# EAGLE schematic xbeeBoard (EAGLE 6.5.0)
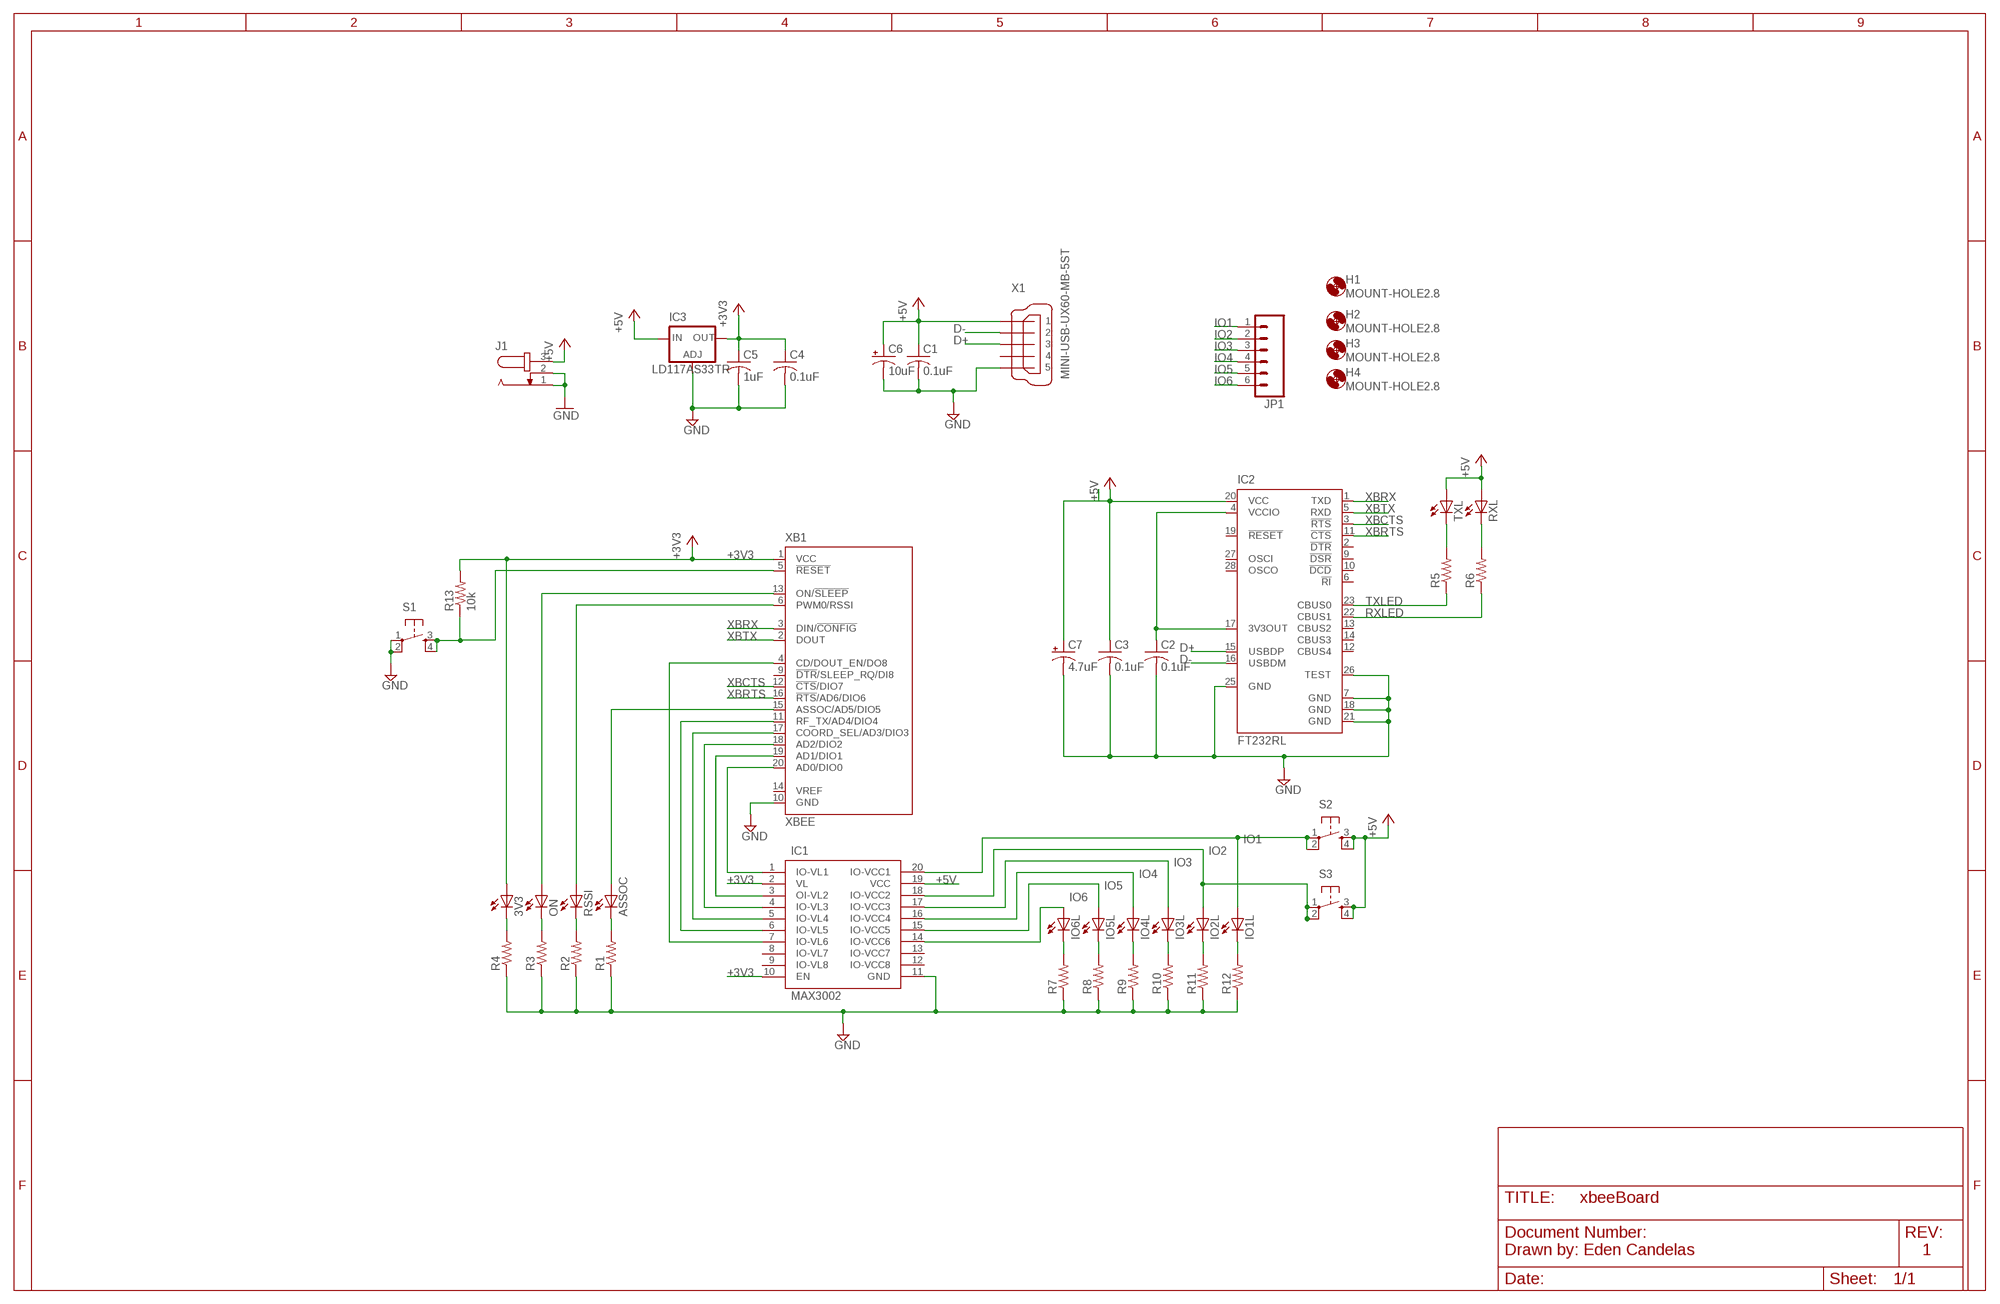
[diagram p0: schematic, sheet 1]

## Parts
3V3  LEDCHIPLED_1206  [CHIPLED_1206]
ASSOC  LEDCHIPLED_1206  [CHIPLED_1206]
C1  0.1uF  C-USC1206K  [C1206K]
C2  0.1uF  C-USC1206K  [C1206K]
C3  0.1uF  C-USC1206K  [C1206K]
C4  0.1uF  C-USC1206K  [C1206K]
C5  1uF  C-USC1206K  [C1206K]
C6  10uF  CAP_POL1206  [EIA3216]
C7  4.7uF  CAP_POL1206  [EIA3216]
H1  MOUNT-HOLE2.8  [2,8]
H2  MOUNT-HOLE2.8  [2,8]
H3  MOUNT-HOLE2.8  [2,8]
H4  MOUNT-HOLE2.8  [2,8]
IC1  MAX3002  [TSSOP-20]
IC2  FT232RL  [SSOP28]
IC3  LD117AS33TR  [SOT223]
IO1L  LEDCHIPLED_1206  [CHIPLED_1206]
IO2L  LEDCHIPLED_1206  [CHIPLED_1206]
IO3L  LEDCHIPLED_1206  [CHIPLED_1206]
IO4L  LEDCHIPLED_1206  [CHIPLED_1206]
IO5L  LEDCHIPLED_1206  [CHIPLED_1206]
IO6L  LEDCHIPLED_1206  [CHIPLED_1206]
J1  JACK-PLUG0  [SPC4077]
JP1  M06LONGPADS  [1X06_LONGPADS]
ON  LEDCHIPLED_1206  [CHIPLED_1206]
R1  R-US_R1206  [R1206]
R2  R-US_R1206  [R1206]
R3  R-US_R1206  [R1206]
R4  R-US_R1206  [R1206]
R5  R-US_R1206  [R1206]
R6  R-US_R1206  [R1206]
R7  R-US_R1206  [R1206]
R8  R-US_R1206  [R1206]
R9  R-US_R1206  [R1206]
R10  R-US_R1206  [R1206]
R11  R-US_R1206  [R1206]
R12  R-US_R1206  [R1206]
R13  10k  R-US_R1206  [R1206]
RSSI  LEDCHIPLED_1206  [CHIPLED_1206]
RXL  LEDCHIPLED_1206  [CHIPLED_1206]
S1  TAC_SWITCHPTH  [TACTILE-PTH]
S2  TAC_SWITCHPTH  [TACTILE-PTH]
S3  TAC_SWITCHPTH  [TACTILE-PTH]
TXL  LEDCHIPLED_1206  [CHIPLED_1206]
X1  MINI-USB-UX60-MB-5ST  [UX60-MB-5ST]
XB1  XBEE  [XBEE]

## Nets
+3V3: 3V3.A C4.1 C5.1 IC1.2(VL) IC1.10(EN) IC3.4(OUT) R13.2 XB1.1(VCC)
+5V: C1.1 C3.1 C6.A(+) C7.A(+) IC1.19(VCC) IC2.20(VCC) IC3.3(IN) J1.3 RXL.A S2.3 S2.4 S3.3 S3.4 TXL.A X1.1
D+: IC2.15(USBDP) X1.3
D-: IC2.16(USBDM) X1.2
GND: C1.2 C2.2 C3.2 C4.2 C5.2 C6.C(-) C7.C(-) IC1.11(GND) IC2.7(GND) IC2.18(GND) IC2.21(GND) IC2.25(GND) IC2.26(TEST) IC3.1(ADJ) J1.1 J1.2 R1.1 R2.1 R3.1 R4.1 R7.1 R8.1 R9.1 R10.1 R11.1 R12.1 S1.1 S1.2 X1.5 XB1.10(GND)
IO1: IC1.20(IO-VCC1) IO1L.A JP1.1 S2.1 S2.2
IO2: IC1.18(IO-VCC2) IO2L.A JP1.2 S3.1 S3.2
IO3: IC1.17(IO-VCC3) IO3L.A JP1.3
IO4: IC1.16(IO-VCC4) IO4L.A JP1.4
IO5: IC1.15(IO-VCC5) IO5L.A JP1.5
IO6: IC1.14(IO-VCC6) IO6L.A JP1.6
N$1: IC1.1(IO-VL1) XB1.20(AD0/DIO0)
N$2: IC1.3(OI-VL2) XB1.19(AD1/DIO1)
N$3: IC1.4(IO-VL3) XB1.18(AD2/DIO2)
N$4: IC1.6(IO-VL5) XB1.11(RF_TX/AD4/DIO4)
N$5: IC1.5(IO-VL4) XB1.17(COORD_SEL/AD3/DIO3)
N$6: ASSOC.A XB1.15(ASSOC/AD5/DIO5)
N$7: RSSI.A XB1.6(PWM0/RSSI)
N$8: ON.A XB1.13(ON/!SLEEP)
N$10: R6.2 RXL.C
N$11: IC1.7(IO-VL6) XB1.4(CD/DOUT_EN/DO8)
N$12: 3V3.C R4.2
N$14: ON.C R3.2
N$15: R2.2 RSSI.C
N$16: ASSOC.C R1.2
N$17: R13.1 S1.3 S1.4 XB1.5(!RESET)
N$18: C2.1 IC2.4(VCCIO) IC2.17(3V3OUT)
N$25: IO6L.C R7.2
N$26: IO5L.C R8.2
N$27: IO4L.C R9.2
N$28: IO3L.C R10.2
N$29: IO2L.C R11.2
N$30: IO1L.C R12.2
RXLED: IC2.22(CBUS1) R6.1
TXL: R5.2 TXL.C
TXLED: IC2.23(CBUS0) R5.1
XBCTS: IC2.3(!RTS) XB1.12(!CTS!/DIO7)
XBRTS: IC2.11(!CTS) XB1.16(!RTS!/AD6/DIO6)
XBRX: IC2.1(TXD) XB1.3(DIN/!CONFIG)
XBTX: IC2.5(RXD) XB1.2(DOUT)
Unconnected: IC1.8(IO-VL7) IC1.9(IO-VL8) IC1.12(IO-VCC8) IC1.13(IO-VCC7) IC2.2(!DTR) IC2.6(!RI) IC2.9(!DSR) IC2.10(!DCD) IC2.12(CBUS4) IC2.13(CBUS2) IC2.14(CBUS3) IC2.19(!RESET) IC2.27(OSCI) IC2.28(OSCO) X1.4 XB1.9(!DTR!/SLEEP_RQ/DI8) XB1.14(VREF)

## Notes on the sheet
- Drawn by: Eden Candelas | 1

## Library data of the parts
3V3 ASSOC IO1L IO2L IO3L IO4L IO5L IO6L ON RSSI RXL TXL = led:LED: LED OSRAM: - CHIPLED LG R971, LG N971, LY N971, LG Q971, LY Q971, LO R971, LY R971 LH N974, LH R974 LS Q976, LO Q976, LY Q976 LO Q996 - Hyper CHIPLED LW Q18S LB Q993, LB Q99A, LB R99A - SideLED LS A670, LO A670, LY A670, LG A670, LP A670 LB A673, LV A673, LT A673, LW A673 LH A674 LY A675 LS A676, LA A676, LO A676, LY A676, LW A676 LS A679, LY A679, LG A679 - Hyper Micro SIDELED® LS Y876, LA Y876, LO Y876, LY Y876 LT Y87S - SmartLED LW L88C, LW L88S LB L89C, LB L89S, LG L890 LS L89K, LO L89K, LY L89K LS L896, LA L896, LO L896, LY L896 - TOPLED LS T670, LO T670, LY T670, LG T670, LP T670 LSG T670, LSP T670, LSY T670, LOP T670, LYG T670 LG T671, LOG T671, LSG T671 LB T673, LV T673, LT T673, LW T673 LH T674 LS T676, LA T676, LO T676, LY T676, LB T676, LH T676, LSB T676, LW T676 LB T67C, LV T67C, LT T67C, LS T67K, LO T67K, LY T67K, LW E67C LS E67B, LA E67B, LO E67B, LY E67B, LB E67C, LV E67C, LT E67C LW T67C LS T679, LY T679, LG T679 LS T770, LO T770, LY T770, LG T770, LP T770 LB T773, LV T773, LT T773, LW T773 LH T774 LS E675, LA E675, LY E675, LS T675 LS T776, LA T776, LO T776, LY T776, LB T776 LHGB T686 LT T68C, LB T68C - Hyper Mini TOPLED® LB M676 - Mini TOPLED Santana® LG M470 LS M47K, LO M47K, LY M47K Source: http://www.osram.convergy.de LUXEON: - LUMILED® LXK2-PW12-R00, LXK2-PW12-S00, LXK2-PW14-U00, LXK2-PW14-V00 LXK2-PM12-R00, LXK2-PM12-S00, LXK2-PM14-U00 LXK2-PE12-Q00, LXK2-PE12-R00, LXK2-PE12-S00, LXK2-PE14-T00, LXK2-PE14-U00 LXK2-PB12-K00, LXK2-PB12-L00, LXK2-PB12-M00, LXK2-PB14-N00, LXK2-PB14-P00, LXK2-PB14-Q00 LXK2-PR12-L00, LXK2-PR12-M00, LXK2-PR14-Q00, LXK2-PR14-R00 LXK2-PD12-Q00, LXK2-PD12-R00, LXK2-PD12-S00 LXK2-PH12-R00, LXK2-PH12-S00 LXK2-PL12-P00, LXK2-PL12-Q00, LXK2-PL12-R00 Source: www.luxeon.com KINGBRIGHT: KA-3528ASYC Source: www.kingbright.com
C1-C5 = rcl:C-US: CAPACITOR, American symbol
C6 C7 = SparkFun-Capacitors:CAP_POL: Capacitor Polarized These are standard SMD and PTH capacitors. Normally 10uF, 47uF, and 100uF in electrolytic and tantalum varieties. Always verify the external diameter of the through hole cap, it varies with capacity, voltage, and manufacturer. The EIA devices should be standard.
H1-H4 = holes:MOUNT-HOLE: MOUNTING HOLE with drill center marker
IC1 = paradoxa:MAX3002: MAX3002 8 channel level traslator 1.2 to 5.5 v bidirectional, no direction pin
IC2 = ftdichip:FT232R: Source: http://www.ftdichip.com/Documents/DataSheets/DS_FT232R_v104.pdf; MPN: FT232RL; OC_FARNELL: 1146032; OC_NEWARK: 91K9918
IC3 = v-reg:LD117A?*: Low drop fixed and adjustable positive voltage regulators 1 A Source: http://www.st.com/stonline/products/literature/ds/7194/ld1117axx.pdf
J1 = con-jack:JACK-PLUG: DC POWER JACK Power Jack, DC, Right Angle, Through Hole, Rated 5A at 16VDC, PC Terminals Distributor: Farnell (www.Farnell.de) Drawing: 84N1161.pdf / 84N1162.pdf Manufacturer: SPC Technology (www.spctechnology.com) Type: SPC4077 / SPC 4078; OC_FARNELL: unknown; OC_NEWARK: unknown
JP1 = SparkFun-Connectors:M06: Header 6 Standard 6-pin 0.1" header. Use with straight break away headers (SKU : PRT-00116), right angle break away headers (PRT-00553), swiss pins (PRT-00743), machine pins (PRT-00117), and female headers (PRT-00115). Molex polarized connector foot print use with SKU : PRT-08094 with associated crimp pins and housings. NOTES ON THE VARIANTS LOCK and LOCK_LONGPADS... This footprint was designed to help hold the alignment of a through-hole component (i.e. 6-pin header) while soldering it into place. You may notice that each hole has been shifted either up or down by 0.005 of an inch from it's more standard position (which is a perfectly straight line). This slight alteration caused the pins (the squares in the middle) to touch the edges of the holes. Because they are alternating, it causes a "brace" to hold the component in place. 0.005 has proven to be the perfect amount of "off-center" position when using our standard breakaway headers. Although looks a little odd when you look at the bare footprint, once you have a header in there, the alteration is very hard to notice. Also,if you push a header all the way into place, it is covered up entirely on the bottom side. This idea of altering the position of holes to aid alignment will be further integrated into the Sparkfun Library for other footprints. It can help hold any component with 3 or more connection pins.
R1-R13 = rcl:R-US_: RESISTOR, American symbol
S1-S3 = SparkFun-Electromechanical:TAC_SWITCH: Momentary Switch Button commonly used for reset or general input. Spark Fun Electronics SKU : COM-00097 SMT- SWCH-08247
X1 = con-hirose:MINI-USB-: MINI USB Connector Source: http://www.hirose.co.jp/cataloge_hp/e24000019.pdf; OC_FARNELL: unknown; OC_NEWARK: unknown
XB1 = maxstream:XBEE: XBee (TM) /XBee-PRO(TM) OEM RF Modules Source: MaxStream, Inc. xbee_productmanual.pdf; MPN: XBP24-Z7UIT-004; OC_FARNELL: 1751799; OC_NEWARK: 34R5507